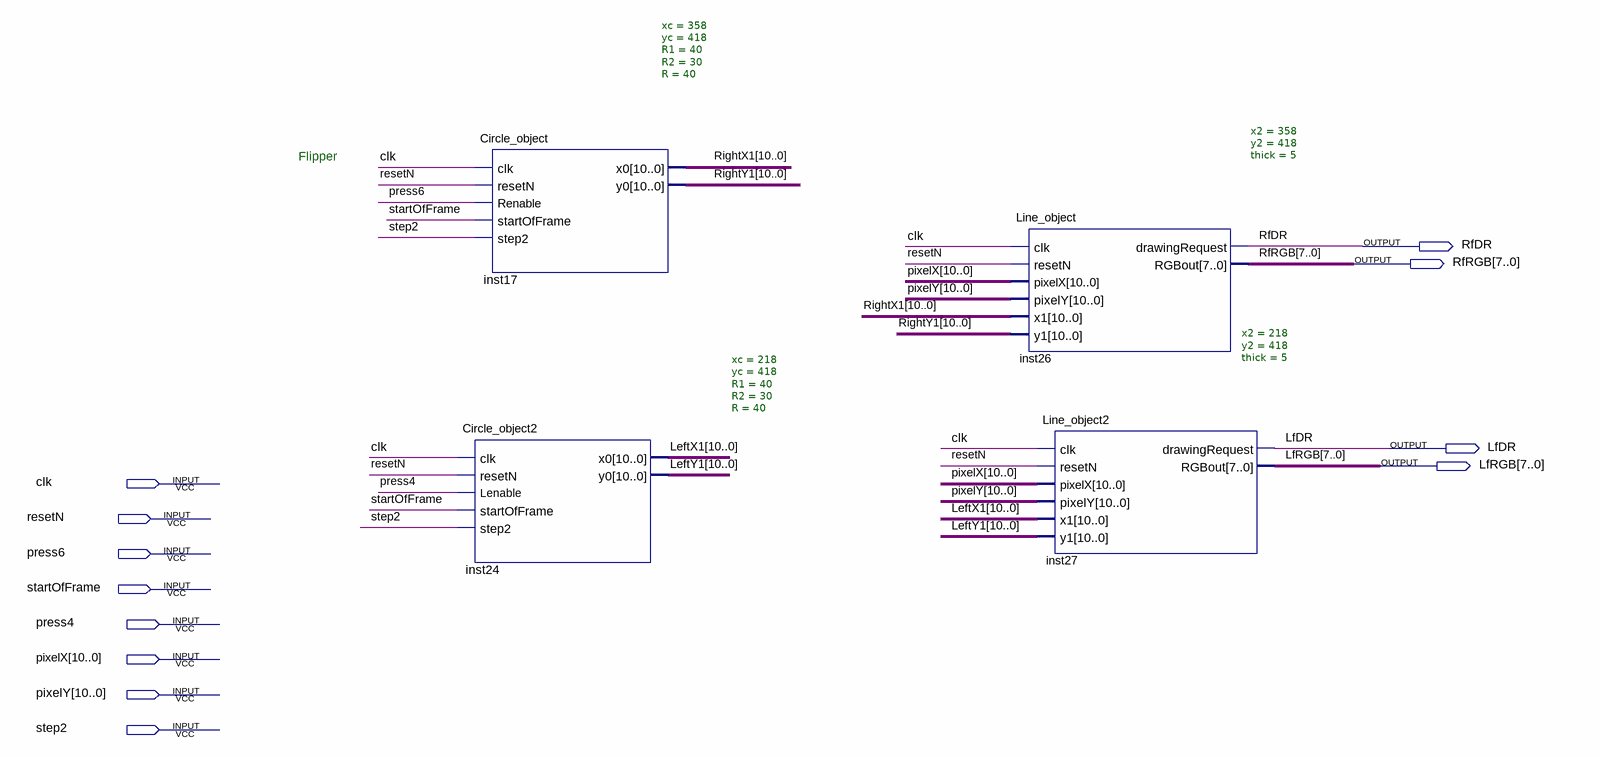
[diagram p0: schematic sheet]
// Quartus schematic Flipper_Block.bdf as structural Verilog: 4 symbols, 12 pins
module Flipper_Block (
  input  clk,
  input  resetN,
  input  press6,
  input  startOfFrame,
  input  press4,
  input  [10:0] pixelX,
  input  [10:0] pixelY,
  input  step2,
  output RfDR,
  output [7:0] RfRGB,
  output LfDR,
  output [7:0] LfRGB
);

  wire [10:0] LeftX1, LeftY1, RightX1, RightY1;

  Circle_object #(.xc(358), .yc(418), .R1(40), .R2(30), .R(40)) inst17 (
    .clk(clk), .resetN(resetN), .Renable(press6), .startOfFrame(startOfFrame), .step2(step2), .x0(RightX1),
    .y0(RightY1));
  Circle_object2 #(.xc(218), .yc(418), .R1(40), .R2(30), .R(40)) inst24 (
    .clk(clk), .resetN(resetN), .Lenable(press4), .startOfFrame(startOfFrame), .step2(step2), .x0(LeftX1),
    .y0(LeftY1));
  Line_object #(.x2(358), .y2(418), .thick(5)) inst26 (
    .clk(clk), .resetN(resetN), .pixelX(pixelX), .pixelY(pixelY), .x1(RightX1), .y1(RightY1),
    .drawingRequest(RfDR), .RGBout(RfRGB));
  Line_object2 #(.x2(218), .y2(418), .thick(5)) inst27 (
    .clk(clk), .resetN(resetN), .pixelX(pixelX), .pixelY(pixelY), .x1(LeftX1), .y1(LeftY1),
    .drawingRequest(LfDR), .RGBout(LfRGB));

  // Notes on the sheet:
  //   Flipper
endmodule
